# EAGLE design PSU1 (EAGLE 9.2.2)

## Sheet 1 of 2
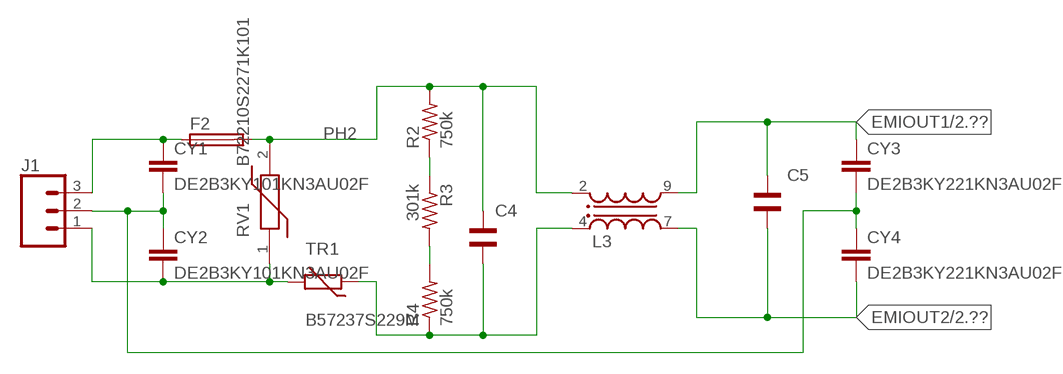
[diagram p0: schematic, sheet 1]

### Parts
C4  WCAP-FTXX_890334025039CS  [WCAP-FTXX_15X18X14X8]
C5  WCAP-FTXX_890334025039CS  [WCAP-FTXX_15X18X14X8]
CY1  DE2B3KY101KN3AU02F  CYYC7B5  [YC7B5]
CY2  DE2B3KY101KN3AU02F  CYYC7B5  [YC7B5]
CY3  DE2B3KY221KN3AU02F  CYYC7B5  [YC7B5]
CY4  DE2B3KY221KN3AU02F  CYYC7B5  [YC7B5]
F2  GSH15  [GSH15]
J1  CONN_03-SCREW-5MM  [SCREWTERMINAL-5MM-3]
L3  WE-CMB_L_744824310  [WE-CMB_L]
R2  750k  R-US_R1206  [R1206]
R3  301k  R-US_R1206  [R1206]
R4  750k  R-US_R1206  [R1206]
RV1  B72210S2271K101  [B72210S2271K101]
TR1  B57237S229M  THERMISTOR_R-7,5  [R-7,5]

### Nets
EMIOUT1: C5.2 CY3.1 L3.9 ; also sheet 2
EMIOUT2: C5.1 CY4.2 L3.7 ; also sheet 2
N$20: R2.1 R3.1
N$25: R3.2 R4.2
N$29: CY1.1 F2.1 J1.3
N$38: CY2.2 J1.1 RV1.1 TR1.2
N$40: C4.2 L3.4 R4.1 TR1.1
N$45: CY1.2 CY2.1 CY3.2 CY4.1 J1.2
PH2: C4.1 F2.2 L3.2 R2.2 RV1.2

## Sheet 2 of 2
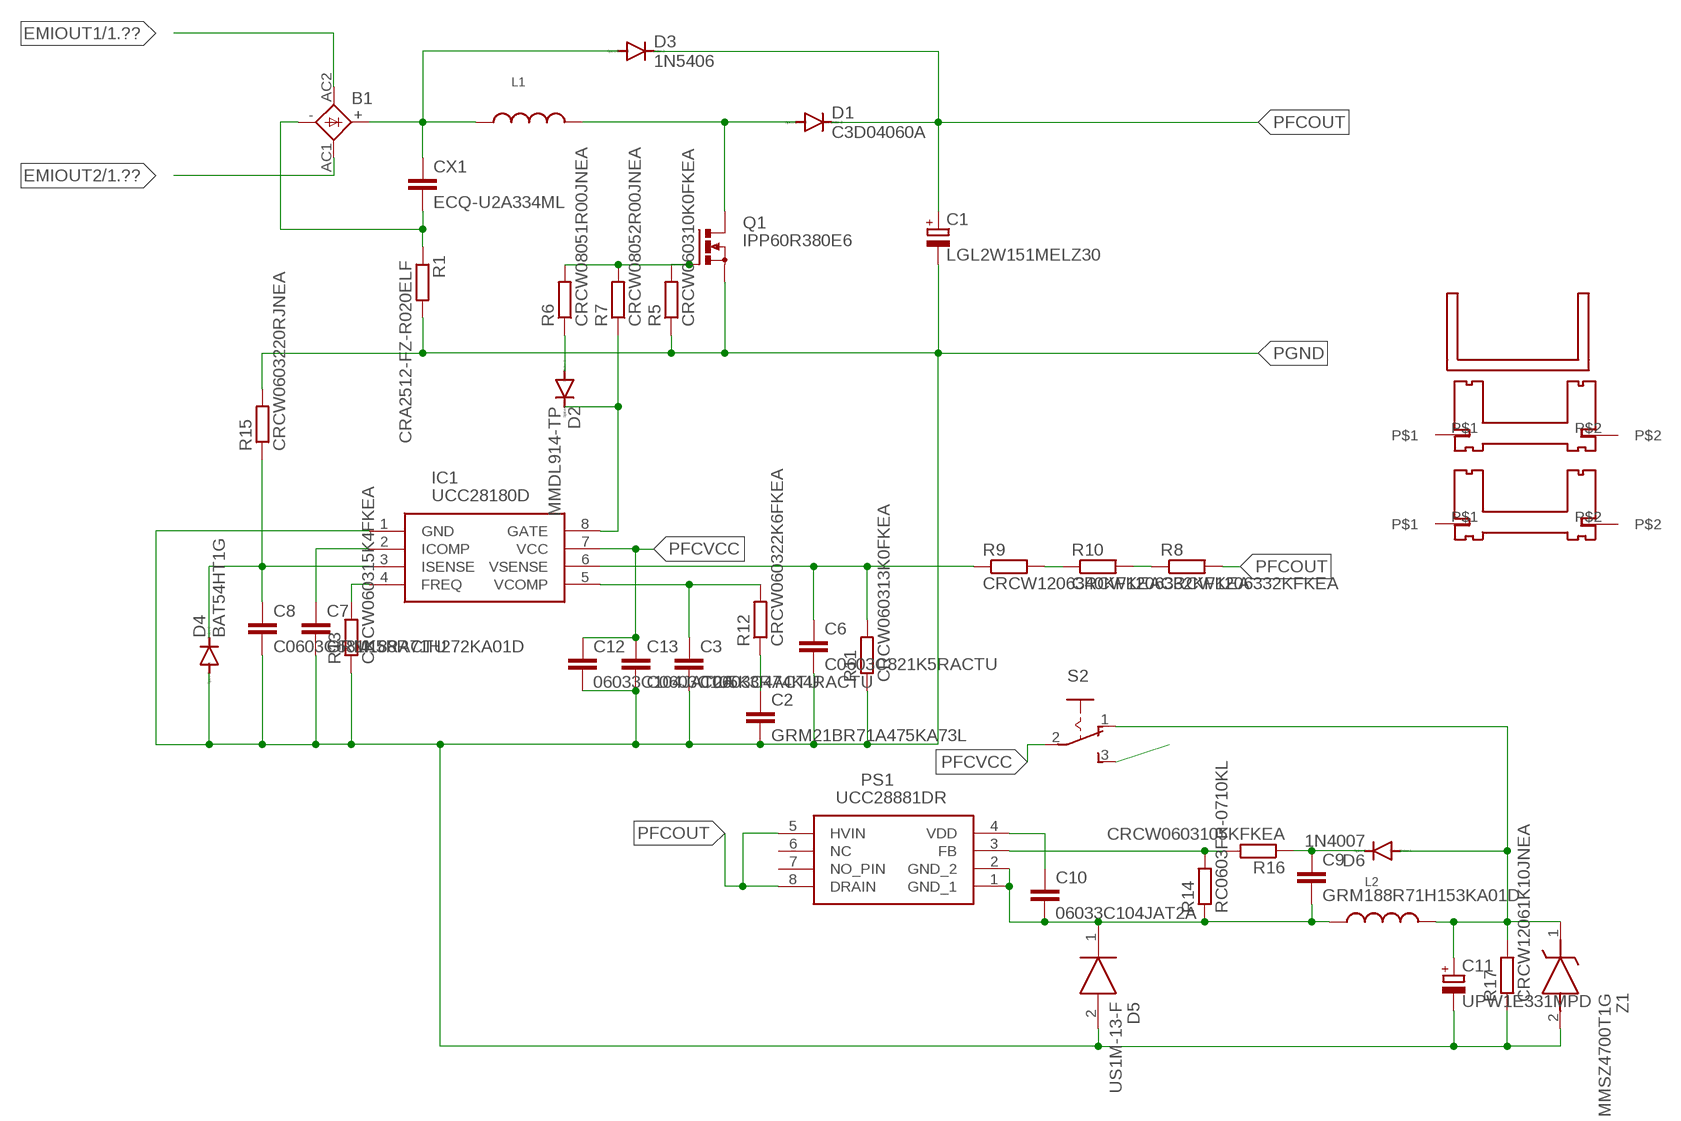
[diagram p1: schematic, sheet 2]

### Parts
B1  GBU4S  [GBU4S]
C1  LGL2W151MELZ30  CPOL-EUE10-22.5  [EB22,5D]
C2  GRM21BR71A475KA73L  C-EUC0805  [C0805]
C3  C0603C474K4RACTU  C-EUC0603  [C0603]
C6  C0603C821K5RACTU  C-EUC0603  [C0603]
C7  GRM188R71H272KA01D  C-EUC0603  [C0603]
C8  C0603C681K5RACTU  C-EUC0603  [C0603]
C9  GRM188R71H153KA01D  C-EUC0603  [C0603]
C10  06033C104JAT2A  C-EUC0603  [C0603]
C11  UPW1E331MPD  CPOL-EUE5-10.5  [E5-10,5]
C12  06033C104JAT2A  C-EUC0603  [C0603]
C13  C0603C105K3RACTU  C-EUC0603  [C0603]
CX1  ECQ-U2A334ML  CXXC15B10  [XC15B10]
D1  C3D04060A  DIODE-TO220V  [TO220ACS]
D2  MMDL914-TP  DIODE-SOD323-R  [SOD323-R]
D3  1N5406  DIODE-DO201-15  [DO201-15]
D4  BAT54HT1G  DIODE-SOD323-R  [SOD323-R]
D5  US1M-13-F  [SODFL5226X240N]
D6  1N4007  DIODE-DO41-7.6  [DO41-7.6]
IC1  UCC28180D  [SOIC127P600X175-8N]
L1  WE-HCF_ROUND_74437529203471  [WE-HCF_ROUND]
L2  WE-TIS_1111_7447471102  [WE-TIS_1111]
PS1  UCC28881DR  [SOIC127P600X175-8N]
Q1  IPP60R380E6  PMOSFET_NTO220BV  [TO220BV]
R1  CRA2512-FZ-R020ELF  R-EU_R2512W  [R2512W]
R5  CRCW060310K0FKEA  R-EU_R0603  [R0603]
R6  CRCW08051R00JNEA  R-EU_R0805  [R0805]
R7  CRCW08052R00JNEA  R-EU_R0805  [R0805]
R8  CRCW1206332KFKEA  R-EU_R1206  [R1206]
R9  CRCW1206340KFKEA  R-EU_R1206  [R1206]
R10  CRCW1206332KFKEA  R-EU_R1206  [R1206]
R11  CRCW060313K0FKEA  R-EU_R0603  [R0603]
R12  CRCW060322K6FKEA  R-EU_R0603  [R0603]
R13  CRCW060315K4FKEA  R-EU_R0603  [R0603]
R14  RC0603FR-0710KL  R-EU_R0805  [R0805]
R15  CRCW0603220RJNEA  R-EU_R0603  [R0603]
R16  CRCW0603105KFKEA  R-EU_R0805  [R0805]
R17  CRCW12061K10JNEA  R-EU_R1206  [R1206]
S2  255SB  [255SB]
U$1  HEAT001  [HEAT01]
U$2  HEAT002  [HEAT02]
U$3  HEAT001  [HEAT01]
Z1  MMSZ4700T1G  [SOD3716X135N]

### Nets
DMOS1: D1.A L1.2 Q1.D
EMIOUT1: B1.AC2(AC1) ; also sheet 1
EMIOUT2: B1.AC1(AC2) ; also sheet 1
N$2: Q1.G R5.2 R6.2 R7.2
N$3: B1.- CX1.2 R1.1
N$4: B1.+ CX1.1 D3.A L1.1
N$7: D2.A R6.1
N$8: D2.C IC1.8(GATE) R7.1
N$9: R8.1 R10.2
N$10: R9.2 R10.1
N$11: C6.1 IC1.6(VSENSE) R9.1 R11.2
N$12: C3.1 IC1.5(VCOMP) R12.2
N$13: IC1.4(FREQ) R13.2
N$14: C8.1 D4.C IC1.3(ISENSE) R15.1
N$15: C7.1 IC1.2(ICOMP)
N$16: C2.1 R12.1
N$17: C9.2 C10.2 D5.1(K) L2.1 PS1.1(GND_1) PS1.2(GND_2) R14.1
N$21: PS1.3(FB) R14.2 R16.2
N$22: C9.1 D6.C R16.1
N$23: C11.+ D6.A L2.2 R17.2 S2.1(O) Z1.1(K)
N$24: C10.1 PS1.4(VDD)
N$34: S2.3(S)
PFCOUT: C1.+ D1.C D3.C PS1.5(HVIN) PS1.8(DRAIN) R8.2
PFCVCC: C12.1 C13.1 IC1.7(VCC) S2.2(P)
PGND: C1.- C2.2 C3.2 C6.2 C7.2 C8.2 C11.- C12.2 C13.2 D4.A D5.2(A) IC1.1(GND) Q1.S R1.2 R5.1 R11.1 R13.1 R15.2 R17.1 Z1.2(A)
Unconnected: PS1.6(NC) PS1.7(NO_PIN) U$1.P$1 U$1.P$2 U$3.P$1 U$3.P$2

## Library data of the parts
B1 = rectifier:GBU4S: GENERAL INSTRUMENT RECTIFIER
C1 C11 = rcl:CPOL-EU: POLARIZED CAPACITOR, European symbol; SPICEPREFIX: C
C2 C3 C6-C10 C12 C13 = rcl:C-EU: CAPACITOR, European symbol; SPICEPREFIX: C
C4 C5 = Wurth_Elektronik_Passive_Capacitors_rev18b:WCAP-FTXX: WCAP-FTXX Film Capacitors Characteristics MKP,Metallized Polypropylene Film Recommended soldering :Wave Operating temperature:-40 °C to +105 °C Climate category: 40/105/56/B Self-healing properties Certificates: cULus, CQC, VDE Applications Safety applications Filter Power supplies Electrical property <http://katalog.we-online.de/media/images/eisos/WCAP-FTXX_pf2.jpg> Details see: http://katalog.we-online.de/pbs/datasheet/890334022007.pdf Created: 2014-09-15 2014 (C) Wurth Elektronik; WE-NUMBER: 890334025039CS/0,47uF
CX1 = rcl:CX: X CAPACITOR for power line; SPICEPREFIX: C
CY1-CY4 = rcl:CY: Y CAPACITOR for power line; SPICEPREFIX: C
D1-D4 D6 = diode:DIODE-: DIODE
D5 = SamacSys_Parts:US1M-13-F: Diode Fast 1A 1000V 75ns SMA Diodes Inc US1M-13-F, SMT Switching Diode, 1000V 1A, 75ns, 2-Pin DO-214AC Source: Datasheet <https://www.diodes.com/assets/Datasheets/ds16008.pdf>; ALLIED_NUMBER: 71028100; ALLIED_PRICE-STOCK: https://www.alliedelec.com/diodesinc-us1m-13-f/71028100/; DESCRIPTION: Diode Fast 1A 1000V 75ns SMA Diodes Inc US1M-13-F, SMT Switching Diode, 1000V 1A, 75ns, 2-Pin DO-214AC; HEIGHT: 2.4mm; MANUFACTURER_NAME: Diodes Inc.; MANUFACTURER_PART_NUMBER: US1M-13-F; MOUSER_PART_NUMBER: 621-US1M-F; MOUSER_PRICE-STOCK: https://www.mouser.com/Search/Refine.aspx?Keyword=621-US1M-F; RS_PART_NUMBER: 7385074P; RS_PRICE-STOCK: http://uk.rs-online.com/web/p/products/7385074P
F2 = fuse:GSH15: FUSE HOLDER grid 15mm, 19649 Wickmann; MPN: 64900001039; OC_FARNELL: 1271673; OC_NEWARK: 02P0318
IC1 = SamacSys_Parts:UCC28180D: TEXAS INSTRUMENTS - UCC28180D - IC, BOOST PFC CONT, GATE DRIVE, SOIC-8 Source: Datasheet <http://www.ti.com/lit/gpn/ucc28180>; DESCRIPTION: TEXAS INSTRUMENTS - UCC28180D - IC, BOOST PFC CONT, GATE DRIVE, SOIC-8; HEIGHT: 1.75mm; MANUFACTURER_NAME: Texas Instruments; MANUFACTURER_PART_NUMBER: UCC28180D; MOUSER_PART_NUMBER: 595-UCC28180D; MOUSER_PRICE-STOCK: https://www.mouser.com/Search/Refine.aspx?Keyword=595-UCC28180D
J1 = SparkFun-Connectors:CONN_03: Multi connection point. Often used as Generic Header-pin footprint for 0.1 inch spaced/style header connections On any of the 0.1 inch spaced packages, you can populate with these: Break Away Headers - Straight <https://www.sparkfun.com/products/116> (PRT-00116) Break Away Male Headers - Right Angle <https://www.sparkfun.com/products/553> (PRT-00553) Female Headers <https://www.sparkfun.com/products/115> (PRT-00115) Break Away Headers - Machine Pin <https://www.sparkfun.com/products/117> (PRT-00117) Break Away Female Headers - Swiss Machine Pin <https://www.sparkfun.com/products/743> (PRT-00743) Stackable Header - 3 Pin (Female, 0.1") <https://www.sparkfun.com/products/13875> (PRT-13875) For SCREWTERMINALS and SPRING TERMINALS visit here: Screw Terimnals on SparkFun.com <https://www.sparkfun.com/search/results?term=Screw+Terminals> (5mm/3.5mm/2.54mm spacing) This device is also useful as a general connection point to wire up your design to another part of your project. Our various solder wires solder well into these plated through hole pads. Hook-Up Wire - Assortment (Stranded, 22 AWG) <https://www.sparkfun.com/products/11375> (PRT-11375) Hook-Up Wire - Assortment (Solid Core, 22 AWG) <https://www.sparkfun.com/products/11367> (PRT-11367) View the entire wire category on our website here <https://www.sparkfun.com/categories/141> Special notes: Molex polarized connector foot print use with SKU : PRT-08232 with associated crimp pins and housings.; PROD_ID: CONN-10134; SF_SKU: PRT-08433
L1 = Wurth_Elektronik_Passive_rev18f:WE-HCF_ROUND: SMD High Current Inductor Characteristics Saturation current up to 75 A Very low core losses (MnZn) Magnetically shielded Operating temperature: –40 °C to +125 °C Current capability up to 32 A Applications Storage inductor for high efficiency DC/DC converters Single and polyphase buck converters Filter for audio applications Optimized for high current boost applications <http://katalog.we-online.de/media/images/v2/Family_WE-HCF_2018.jpg> Details see: http://katalog.we-online.de/en/pbs/WE-HCF#vs_ct:1 Created by Yingchun,Shan 2017-12-04 2017(C) Wurth Elektronik; WE-NUMBER: 74437529203471/470uH
L2 = Wurth_Elektronik_Passive_rev18f:WE-TIS_1111: Shielded Radial Leaded Wire Wound Inductor Characteristics Shielded radial through-hole inductor High rated and saturation current High inductance values Low stray field Applications Filter choke Storage choke Class D amplifiers <http://katalog.we-online.de/media/images/v2/Family_WE-TIS.jpg> Details see: http://katalog.we-online.de/en/pbs/WE-TIS? Updated by Dan Xu 2014-07-11 2014 (C) Wurth Elektronik; WE-NUMBER: 7447471102/1000uH
L3 = Wurth_Elektronik_Passive_rev18f:WE-CMB: WE-CMB Common Mode Power Line Choke Characteristics With this product you can achieve high suppression of asymmetric interferences even at low frequency ranges Broadband filtering because of low capacitance winding technique Very compact design Highest possible current with small sizes High interference compression asymmetric interference rates also at low frequence range Custom designs on request Operating temperature: –40 ºC to +125 ºC Applications Power electronics Power line input and output filter For filtering of devices without a stable ground connection Radio interference suppression in motors Suppression of common mode noise <http://katalog.we-online.de/media/images/v2/Family_WE-CMB_XS-XXL.jpg> Details see: http://katalog.we-online.de/en/pbs/WE-CMB? Updated by Dan Xu 2014-06-30 2014 (C) Wurth Elektronik; WE-NUMBER: 744824310/10mH
PS1 = SamacSys_Parts:UCC28881DR: 700-V Lowest Quiescent Current Off-Line Switcher Source: Datasheet <http://www.ti.com/lit/ds/symlink/ucc28881.pdf>; DESCRIPTION: 700-V Lowest Quiescent Current Off-Line Switcher; HEIGHT: 1.75mm; MANUFACTURER_NAME: Texas Instruments; MANUFACTURER_PART_NUMBER: UCC28881DR; MOUSER_PART_NUMBER: 595-UCC28881DR; MOUSER_PRICE-STOCK: https://www.mouser.com/Search/Refine.aspx?Keyword=595-UCC28881DR
Q1 = transistor-power:PMOSFET_N: Power MOSFET N-Channel
R1 R5-R17 = rcl:R-EU_: RESISTOR, European symbol; SPICEPREFIX: R
R2-R4 = rcl:R-US_: RESISTOR, American symbol; SPICEPREFIX: R
RV1 = SamacSys_Parts:B72210S2271K101: EPCOS - B72210S2271K101 - VARISTOR, MOV, 710V, DISC 10MM Source: Datasheet <https://componentsearchengine.com/Datasheets/1/B72210S2271K101.pdf>; DESCRIPTION: EPCOS - B72210S2271K101 - VARISTOR, MOV, 710V, DISC 10MM; HEIGHT: 15mm; MANUFACTURER_NAME: EPCOS; MANUFACTURER_PART_NUMBER: B72210S2271K101; MOUSER_PART_NUMBER: 871-B72210S2271K101; MOUSER_PRICE-STOCK: https://www.mouser.com/Search/Refine.aspx?Keyword=871-B72210S2271K101
S2 = switch:255SB: SLIDING SWITCH Distributor Buerklin, 11G810
TR1 = discrete:THERMISTOR_: Thermo Resistor
U$1 U$3 = HEATMOSFET:HEAT001
U$2 = HEATMOSFET:HEAT002
Z1 = SamacSys_Parts:MMSZ4700T1G: 13 V Low Current ZenerDiodeVoltage Regulator Source: Datasheet <http://www.onsemi.com/pub/Collateral/MMSZ4678T1-D.PDF>; ALLIED_NUMBER: 70465560; ALLIED_PRICE-STOCK: https://www.alliedelec.com/on-semiconductor-mmsz4700t1g/70465560/; DESCRIPTION: 13 V Low Current ZenerDiodeVoltage Regulator; HEIGHT: 1.35mm; MANUFACTURER_NAME: ON Semiconductor; MANUFACTURER_PART_NUMBER: MMSZ4700T1G; MOUSER_PART_NUMBER: 863-MMSZ4700T1G; MOUSER_PRICE-STOCK: https://www.mouser.com/Search/Refine.aspx?Keyword=863-MMSZ4700T1G; RS_PART_NUMBER: 8021853P; RS_PRICE-STOCK: http://uk.rs-online.com/web/p/products/8021853P

## Net classes
1 custom: width 0.203 mm, drill 0.305 mm, clearance 0.152 mm

## Board
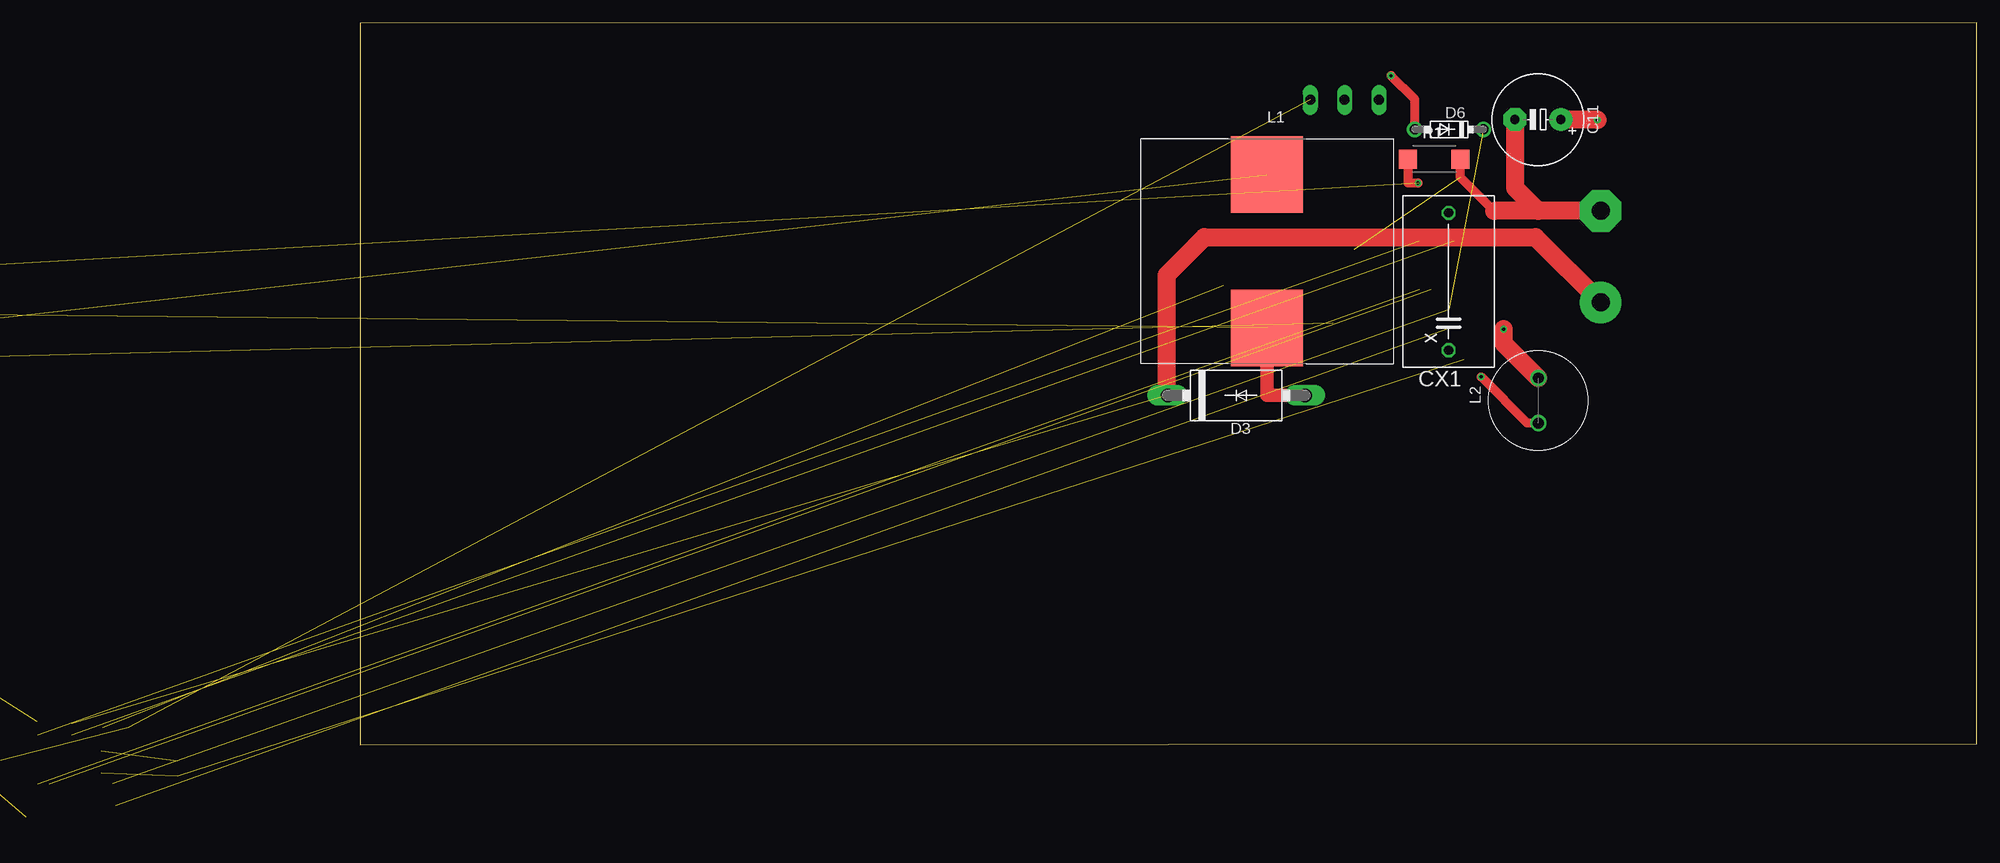
[diagram p2: board, top side]
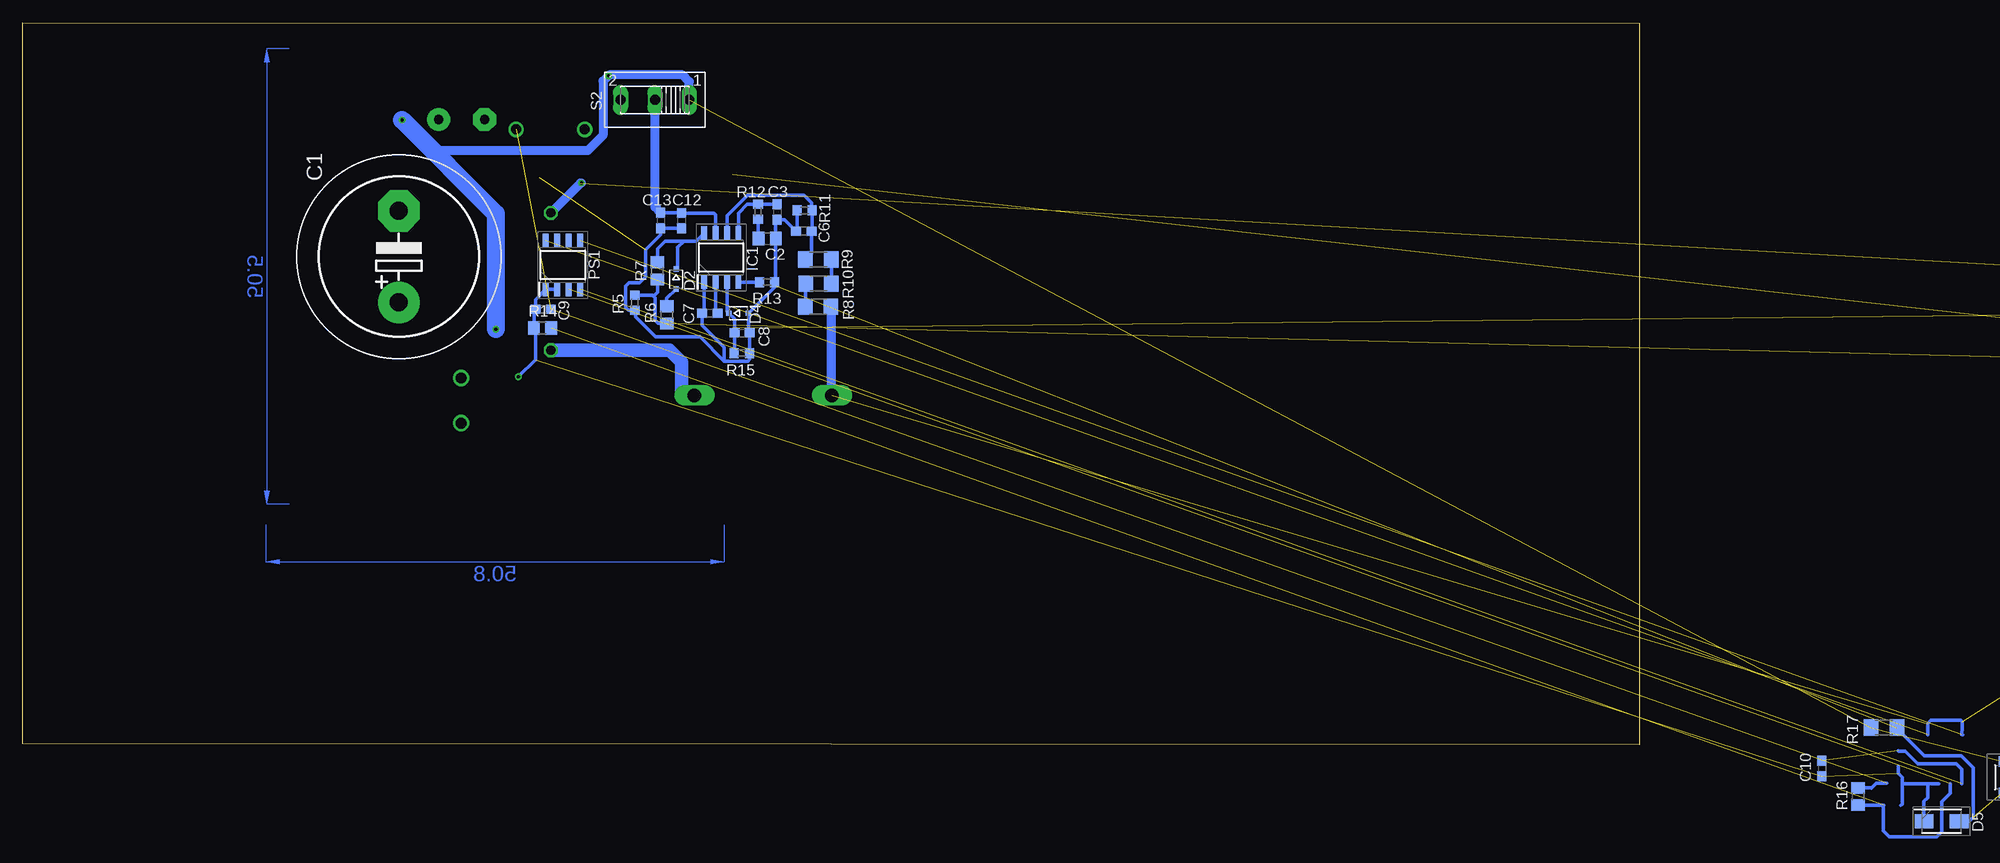
[diagram p3: board, bottom side, seen from below]

Size 179.35 x 80.08 mm. Coordinates in mm from the lower left corner, seen from the top.
Outline: 0,0 179.35,0.08 179.35,80.08 0,80 0,0
Copper layers (1*16): Top 0.035mm / dielectric 1.5mm / Bottom 0.035mm
Design rules "default *": minimum track width 6mil, minimum drill 0.35mm, track to track 6mil, track to pad 6mil, pad to pad 6mil, via to via 6mil, smd to smd 6mil, copper to edge 40mil, drill to drill 6mil, minimum pad ring 10mil, minimum via ring 8mil, stop-mask expansion 4mil, vias tented up to drill 0mil, thermal gap 10mil

### Footprints (pad centres in the part's own frame; a part is rotated, then mirrored left to right if it is on the bottom)
GBU4S = drill 1.499 long: + 7.62,0; - -7.62,0; AC1 2.54,0; AC2 -2.54,0
EB22,5D = drill 2.007 pad 4.597: + -5.08,0 | drill 2.007 pad 4.597 octagon: - 5.08,0
C0805 = smd 1.3 x 1.5: 1 -0.95,0; 2 0.95,0
C0603 = smd 1.1 x 1: 1 -0.85,0; 2 0.85,0
WCAP-FTXX_15X18X14X8 = drill 1.1: 1 -7.5,0; 2 7.5,0
E5-10,5 = drill 1.016 pad 2.54: + -2.54,0 | drill 1.016 pad 2.54 octagon: - 2.54,0
XC15B10 = drill 1.016 octagon: 1 -7.62,0; 2 7.62,0
YC7B5 = drill 1.118 octagon: 1 -3.81,0; 2 3.81,0
TO220ACS = drill 1.016 long: A 2.54,-2.54; C -2.54,-2.54
SOD323-R = smd 0.6 x 0.6: A 1.1,0; C -1.1,0
DO201-15 = drill 1.499 long: A 7.62,0; C -7.62,0
SODFL5226X240N = smd 2.09 x 1.53: 1 -1.95,0; 2 1.95,0
DO41-7.6 = drill 1.1 pad 1.7: A 3.81,0; C -3.81,0
GSH15 = drill 1.321 pad 2.54 long: 1 -7.62,0; 2 7.62,0 | hole 2.794: 0,0
SOIC127P600X175-8N = smd 1.528 x 0.65: 1 -2.711,1.905; 2 -2.711,0.635; 3 -2.711,-0.635; 4 -2.711,-1.905; 5 2.711,-1.905; 6 2.711,-0.635; 7 2.711,0.635; 8 2.711,1.905
SCREWTERMINAL-5MM-3 = drill 1.3 pad 2.413 square: 1 0,0 | drill 1.3 pad 2.413: 2 5,0; 3 10,0
WE-HCF_ROUND = smd 8.5 x 8: 1 -8.5,0; 2 8.5,0
WE-TIS_1111 = drill 1.2: 1 -2.5,0; 2 2.5,0
WE-CMB_L = drill 1.3: 2 6,5; 4 6,-5; 7 -6,-5; 9 -6,5
TO220BV = drill 1.016 long: D 0,-2.54; G -2.54,-2.54; S 2.54,-2.54
R2512W = smd 2 x 2.1: 1 -2.896,0; 2 2.896,0
R1206 = smd 1.6 x 1.803: 1 -1.422,0; 2 1.422,0
R0603 = smd 1 x 1.1: 1 -0.85,0; 2 0.85,0
R0805 = smd 1.3 x 1.5: 1 -0.95,0; 2 0.95,0
B72210S2271K101 = drill 1.05 pad 1.575: 1 -3.75,0.9; 2 3.75,-0.9
255SB = drill 1.118 long: 1 -3.81,0; 2 0,0; 3 3.81,0
R-7,5 = drill 0.813 pad 1.6 octagon: 1 -3.81,0; 2 3.81,0
HEAT01 = drill 0.6 octagon: P$1 -23,-4; P$2 -8,-4
SOD3716X135N = smd 1.15 x 0.8: 1 -1.75,0; 2 1.75,0

### Placement (x,y rotation side)
B1  -117.82,48.32 0 top  (outside the outline)
C1  137.61,54.11 90 bottom
C2  96.74,56.12 0 bottom
C3  95.62,59.07 270 bottom
C4  -149.72,42.53 0 top  (outside the outline)
C5  -111.19,65.62 270 top  (outside the outline)
C6  92.68,56.93 180 bottom
C7  103.12,47.81 180 bottom
C8  99.54,45.66 0 bottom
C9  121.59,48.26 180 bottom
C10  -20.25,-2.64 270 bottom  (outside the outline)
C11  130.65,69.32 180 top
C12  106.24,58.1 270 bottom
C13  108.55,58.13 270 bottom
CX1  120.74,51.35 90 top
CY1  -146.65,51.04 180 top  (outside the outline)
CY2  -146.88,70.82 0 top  (outside the outline)
CY3  -146.85,64.04 180 top  (outside the outline)
CY4  -146.83,57.56 0 top  (outside the outline)
D1  -88.2,31.66 180 top  (outside the outline)
D2  106.85,51.62 270 bottom
D3  97.18,38.73 0 top
D4  99.92,47.84 0 bottom
D5  -33.53,-8.5 0 bottom  (outside the outline)
D6  120.79,68.23 180 top
F2  -151.83,31.25 0 top  (outside the outline)
IC1  101.85,54.01 90 bottom
J1  -161.99,69.55 270 top  (outside the outline)
L1  100.6,54.71 90 top
L2  130.68,38.15 90 top
L3  -91.43,65.59 90 top  (outside the outline)
PS1  119.42,53.18 90 bottom
Q1  -88.18,44.43 0 bottom  (outside the outline)
R1  119.14,64.93 0 top
R2  -117.01,72.27 90 top  (outside the outline)
R3  -119.95,72.22 90 top  (outside the outline)
R4  -123,72.12 90 top  (outside the outline)
R5  111.42,49.01 90 bottom
R6  107.89,47.66 270 bottom
R7  108.91,52.54 270 bottom
R8  91.1,48.55 0 bottom
R9  91.08,53.78 0 bottom
R10  91.05,51.12 180 bottom
R11  92.6,59.24 0 bottom
R12  97.76,59.09 90 bottom
R13  96.77,51.29 180 bottom
R14  121.66,46.18 0 bottom
R15  99.56,43.42 0 bottom
R16  -24.28,-5.76 270 bottom  (outside the outline)
R17  -27.15,1.89 180 bottom  (outside the outline)
RV1  -133.72,54.95 270 top  (outside the outline)
S2  109.2,71.51 180 bottom
TR1  -126.66,69.83 270 top  (outside the outline)
U$1  -72.68,49.49 0 top  (outside the outline)
U$2  -108.6,32.93 180 top  (outside the outline)
U$3  -103.65,26.63 180 top  (outside the outline)
Z1  -40.27,-3.62 270 bottom  (outside the outline)

### Tracks (layer width: path | path; a pad name or v marks a point on that pad's centre or on a via)
DMOS1  (2 unrouted)
EMIOUT1  (3 unrouted)
EMIOUT2  (3 unrouted)
N$2  (1 unrouted)
  Bottom 0.4: 109.49,49.86 109.24,49.86 108.91,50.19 R7.2 | R6.2 108.83,46.71 109.2,47.08 109.2,49.57 109.49,49.86 | 109.49,49.86 R5.2
N$3  (via drill 0.35)  (1 unrouted)
  Top 1: R1.1 116.24,62.28 v117.35,62.28
  Bottom 1: CX1.2 120.74,58.99 117.45,62.28 v117.35,62.28
N$4  (1 unrouted)
  Top 1.5: L1.1 100.6,38.73 D3.A
  Bottom 1.5: CX1.1 107.6,43.73 106.25,42.38 106.25,38.73 D3.A
N$7
  Bottom 0.4: D2.A 107.89,49.48 R6.1
N$8
  Bottom 0.3: 106.67,52.72 D2.C
  Bottom 0.4: IC1.8 104.66,55.82 105.99,55.82 | 105.99,55.82 106.67,55.14 106.67,52.72 | 105.99,55.82 108.07,55.82 108.91,54.98 R7.1
N$9
  Bottom 0.4: R10.2 92.47,48.6 R8.1
N$10
  Bottom 0.4: R9.2 89.63,53.76 R10.1
N$11
  Bottom 0.4: IC1.6 101.21,58.63 98.92,60.93 92.65,60.93 91.81,60.09 91.81,59.31 R11.2 91.75,57.01 C6.1 91.83,54.46 R9.1
N$12
  Bottom 0.3: IC1.5 99.94,57.31
  Bottom 0.4: IC1.5 99.94,58.95 98.96,59.93 97.77,59.93 R12.2 95.65,59.94 C3.1
N$13
  Bottom 0.4: IC1.4 R13.2
N$14
  Bottom 0.2: 101.21,51.05 IC1.3
  Bottom 0.4: IC1.3 101.21,48.04 D4.C 100.39,47.21 C8.1 100.39,43.45 R15.1
N$15
  Bottom 0.4: IC1.2 102.48,48.03 C7.1
N$16
  Bottom 0.4: R12.1 97.76,56.19 C2.1
N$17  (via drill 0.35)  (2 unrouted)
  Top 1: L2.1 129.47,35.65 v124.35,40.78
  Bottom 0.4: -31.98,-4.33 -33.25,-4.33 -33.22,-4.35 | -31.98,-4.33 -29.16,-4.33 -29.14,-4.31 | -29.14,-4.31 -29.14,-6.6 -29.02,-6.72 | -29.14,-4.31 -29.14,-3.61 -28.73,-3.19 -28.73,-2.42 -28.75,-2.39 | D5.1 -31.58,-6.29 -31.98,-5.89 -31.98,-4.33 | v124.35,40.78 122.42,42.7 122.42,45.98 R14.1 122.61,48.09 C9.2 122.44,49.35 PS1.1 PS1.2
N$20  (1 unrouted)
N$21  (3 unrouted)
  Bottom 0.4: R16.2 -24.3,-6.72 -27.12,-6.72 -27.08,-6.76 -27.08,-9.57 -27.74,-10.23 -32.99,-10.23 -33.55,-9.67 -33.55,-6.34 -34.52,-5.38 -34.52,-4.33
N$22  (2 unrouted)
  Bottom 0.4: -27.44,-4.31 -26.26,-4.31 -25.75,-4.82 -25.74,-4.81 R16.1 -24.26,-4.78
N$23  (via drill 0.35)  (2 unrouted)
  Top 1: D6.A 116.98,71.55 v114.35,74.18
  Top 2: v137.25,69.28 137.2,69.32 C11.+ | L2.2 126.85,44.48 v126.85,46.08
  Bottom 1: S2.1 105.39,73.52 106.15,74.28 114.25,74.28 v114.35,74.18 114.95,73.58 114.95,67.58 116.65,65.88 133.85,65.88 v137.25,69.28
  Bottom 2: v137.25,69.28 126.85,58.88 v126.85,46.08
N$24  (2 unrouted)
  Bottom 0.4: -28.75,-0.69 -28.79,-0.73 -29.49,-0.73 -30.89,-2.13 -35.18,-2.13 -35.79,-2.74 -35.79,-4.33
N$25  (1 unrouted)
N$29  (2 unrouted)
N$38  (3 unrouted)
N$40  (3 unrouted)
N$45  (4 unrouted)
PFCOUT  (4 unrouted)
  Top 2: C1.+ 130.36,56.28 93.65,56.28 89.45,52.08 89.45,38.84 D3.C
  Bottom 0.4: -31.98,1.09 -31.98,2.29 -32.36,2.67 -35.66,2.67 -35.81,2.52 -35.81,1.84 -35.79,1.19 | -35.79,1.19 -35.79,1.09 | -35.88,1.1 -35.79,1.19 | R8.2 89.43,48.3
  Bottom 1: R8.2 89.68,38.85 D3.C
PFCVCC
  Bottom 0.4: IC1.7 102.48,58.79 102.65,58.95 C12.1 106.27,58.98 C13.1
  Bottom 1: C13.1 109.2,59.63 S2.2
PGND  (4 unrouted)
  Top 1: 125.77,59.19 122.03,62.93 R1.2
  Top 2: C1.- 130.65,59.19 | 130.65,59.19 125.77,59.19 | C11.- 128.11,61.74 130.65,59.19
  Bottom 0.3: IC1.1 103.8,51.35
  Bottom 0.4: IC1.1 103.75,48.03 C7.2 103.97,46.51 101.5,44.04 101.5,42.54 | R13.1 95.79,51.42 | 95.79,51.42 95.77,51.45 95.77,50.89 D4.A 98.82,45.79 C8.2 98.69,43.45 R15.2 98.71,42.72 98.89,42.54 101.5,42.54 | 95.79,51.42 C2.2 95.79,58.05 C3.2 94.81,58.22 C6.2 93.45,57.01 R11.1 | C12.2 106.27,57.28 C13.2 108.55,56.54 110.21,54.89 110.21,51.9 110.91,51.19 112.09,51.19 112.44,50.84 112.44,48.48 112.12,48.16 R5.1 111.33,48.16 111.33,47.46 109.1,45.23 104.21,45.23 101.5,42.53 101.5,42.54 | -28.79,2.1 R17.1 -28.57,1.84 -31.62,-1.21 -35.71,-1.21 -37.06,-2.56 -37.06,-8.04 -36.6,-8.5 D5.2
PH2  (4 unrouted)
(copper drawn outside any net)
  shapes: Bottom area x2